# EAGLE design buisiness_card (EAGLE 7.5.0)
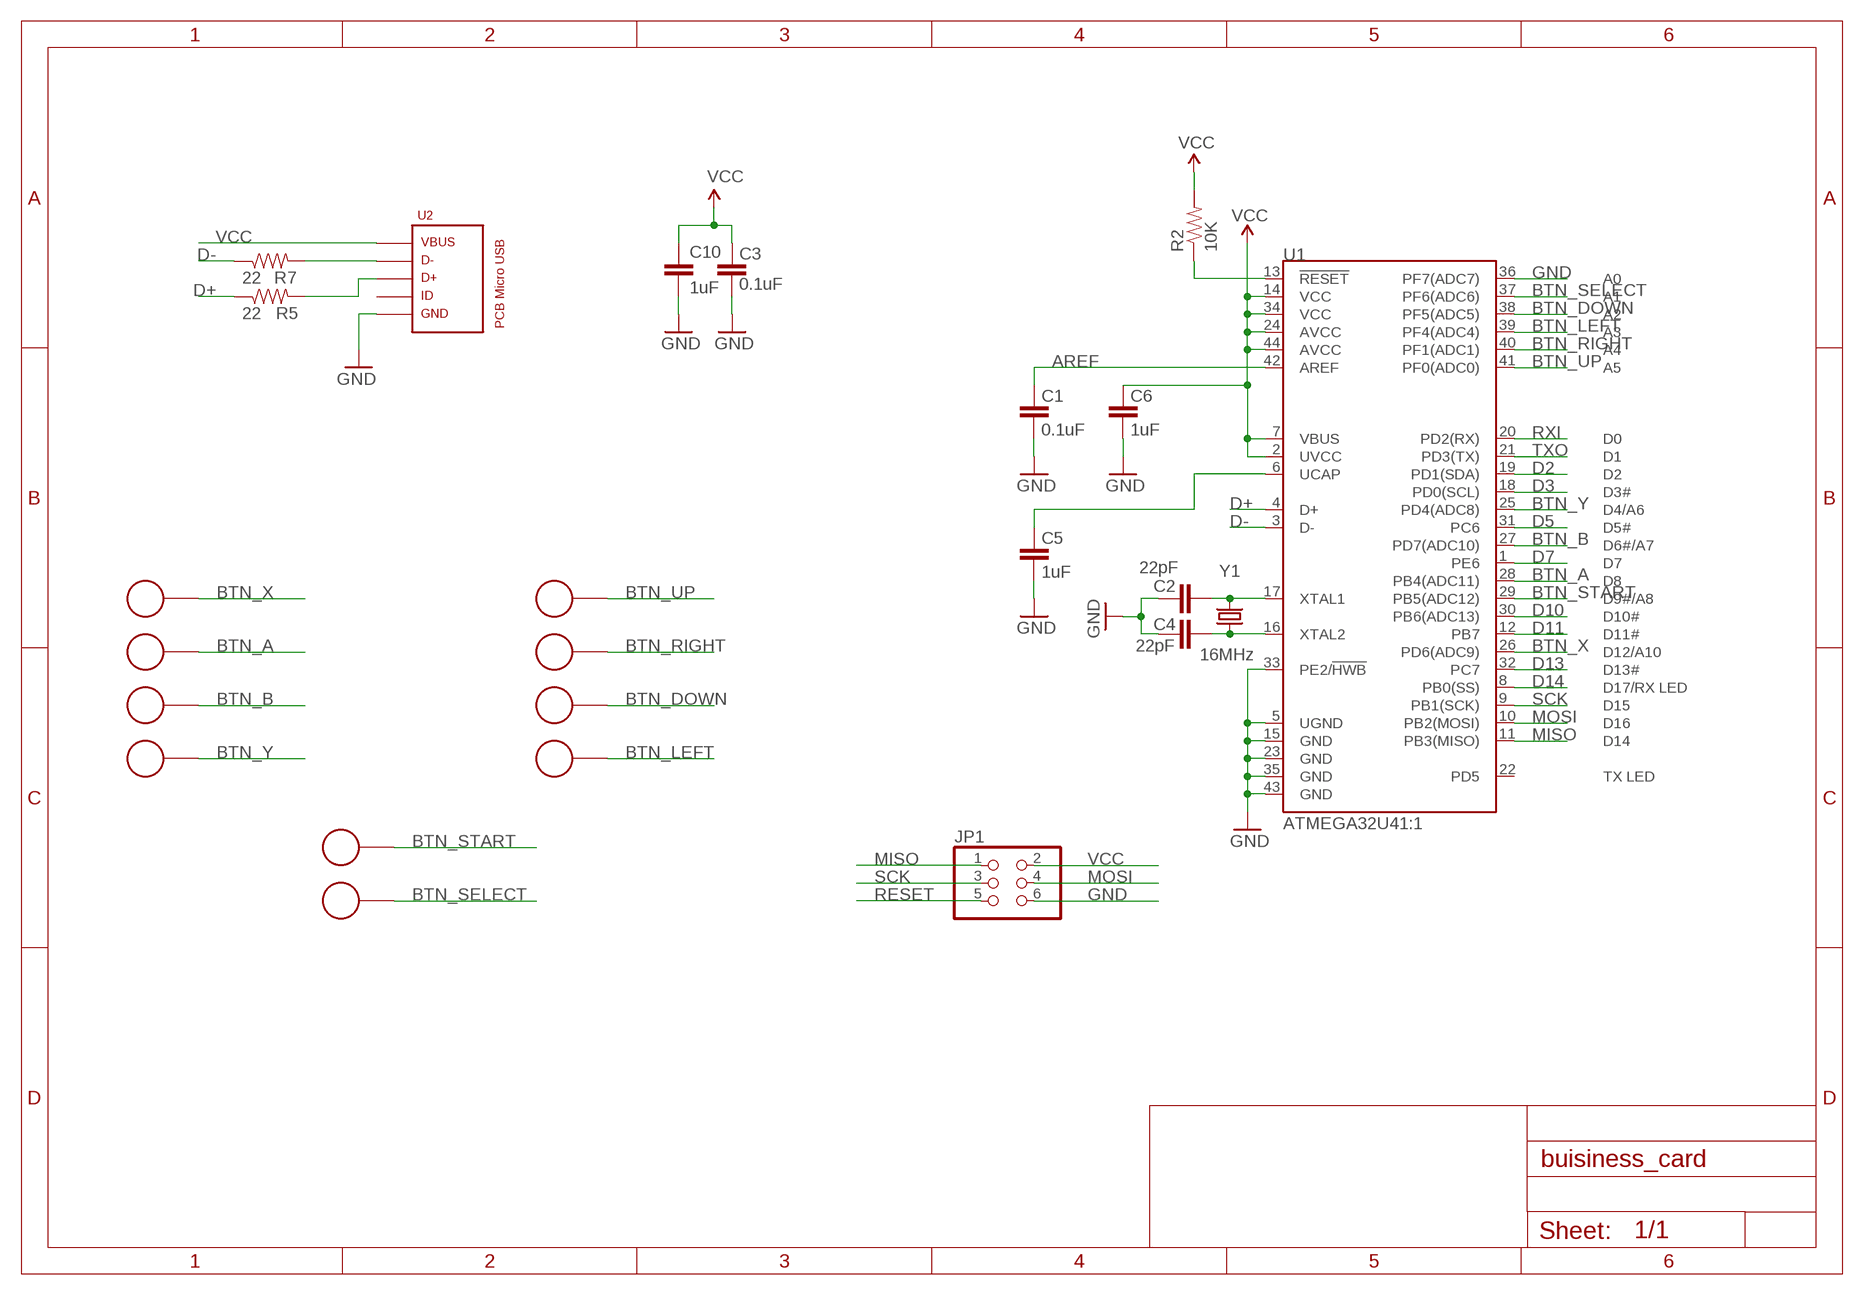
[diagram p0: schematic, sheet 1]

## Parts
B1  CAPACITIVE_BUTTON  [ROUND_CAP_BUTTON]
B2  CAPACITIVE_BUTTON  [ROUND_CAP_BUTTON]
B3  CAPACITIVE_BUTTON  [ROUND_CAP_BUTTON]
B4  CAPACITIVE_BUTTON  [ROUND_CAP_BUTTON]
B5  CAPACITIVE_BUTTON  [ROUND_CAP_BUTTON]
B6  CAPACITIVE_BUTTON  [ROUND_CAP_BUTTON]
B7  CAPACITIVE_BUTTON  [ROUND_CAP_BUTTON]
B8  CAPACITIVE_BUTTON  [ROUND_CAP_BUTTON]
B9  CAPACITIVE_BUTTON  [ROUND_CAP_BUTTON]
B10  CAPACITIVE_BUTTON  [ROUND_CAP_BUTTON]
C1  0.1uF  CAP0603-CAP  [0603-CAP]
C2  22pF  CAP0603-CAP  [0603-CAP]
C3  0.1uF  CAP0603-CAP  [0603-CAP]
C4  22pF  CAP0603-CAP  [0603-CAP]
C5  1uF  CAP0603-CAP  [0603-CAP]
C6  1uF  CAP0603-CAP  [0603-CAP]
C10  1uF  CAP0603-CAP  [0603-CAP]
JP1  PINHD-2X3  [2X03]
R2  10K  RESISTOR0603-RES  [0603-RES]
R5  22  RESISTOR0603-RES  [0603-RES]
R7  22  RESISTOR0603-RES  [0603-RES]
U1  ATMEGA32U41:1  [QFN-44-NOPAD_1:1]
U2  PCB_MICRO_USB_BSS_2  [USB_TYPE_B_SS_2]
Y1  16MHz  CRYSTAL5X3  [CRYSTAL-SMD-5X3]

## Nets
AREF: C1.2 U1.42(AREF)
BTN_A: B2.P$1 U1.28(PB4(ADC11))
BTN_B: B3.P$1 U1.27(PD7(ADC10))
BTN_DOWN: B7.P$1 U1.38(PF5(ADC5))
BTN_LEFT: B8.P$1 U1.39(PF4(ADC4))
BTN_RIGHT: B6.P$1 U1.40(PF1(ADC1))
BTN_SELECT: B10.P$1 U1.37(PF6(ADC6))
BTN_START: B9.P$1 U1.29(PB5(ADC12))
BTN_UP: B5.P$1 U1.41(PF0(ADC0))
BTN_X: B1.P$1 U1.26(PD6(ADC9))
BTN_Y: B4.P$1 U1.25(PD4(ADC8))
D2: U1.19(PD1(SDA))
D3: U1.18(PD0(SCL))
D5: U1.31(PC6)
D7: U1.1(PE6)
D10: U1.30(PB6(ADC13))
D11: U1.12(PB7)
D13: U1.32(PC7)
D14: U1.8(PB0(SS))
D+: R5.1 U1.4(D+)
D-: R7.1 U1.3(D-)
GND [vcc]: C1.1 C2.2 C3.1 C4.2 C5.1 C6.1 C10.2 JP1.6 U1.5(UGND) U1.15(GND) U1.23(GND) U1.33(PE2/!HWB) U1.35(GND) U1.36(PF7(ADC7)) U1.43(GND) U2.5
MISO: JP1.1 U1.11(PB3(MISO))
MOSI: JP1.4 U1.10(PB2(MOSI))
N$13: C4.1 U1.16(XTAL2) Y1.1
N$14: C2.1 U1.17(XTAL1) Y1.3
N$15: C5.2 U1.6(UCAP)
N$18: R7.2 U2.2
N$19: R5.2 U2.3
RESET: JP1.5 R2.1 U1.13(!RESET)
RXI: U1.20(PD2(RX))
SCK: JP1.3 U1.9(PB1(SCK))
TXO: U1.21(PD3(TX))
VCC: C3.2 C6.2 C10.1 JP1.2 R2.2 U1.2(UVCC) U1.7(VBUS) U1.14(VCC) U1.24(AVCC) U1.34(VCC) U1.44(AVCC) U2.1
Unconnected: U1.22(PD5) U2.4

## Library data of the parts
B1-B10 = MyLibrary:CAPACITIVE_BUTTON
C1-C6 C10 = SparkFun:CAP: Capacitor Standard 0603 ceramic capacitor, and 0.1" leaded capacitor.
JP1 = pinhead:PINHD-2X3: PIN HEADER
R2 R5 R7 = SparkFun:RESISTOR: Resistor Basic schematic elements and footprints for 0603, 1206, and PTH resistors.
U1 = SparkFun-DigitalIC:ATMEGA32U4: Atmel 44-pin 8-bit Microcontroller with 32KBytes of ISP Flash and USB Controller
U2 = USB_pcb_connectors:PCB_MICRO_USB_B
Y1 = SparkFun:CRYSTAL: Crystals Various standard crystals. Proven footprints. Spark Fun Electronics SKU : COM-00534

## Board
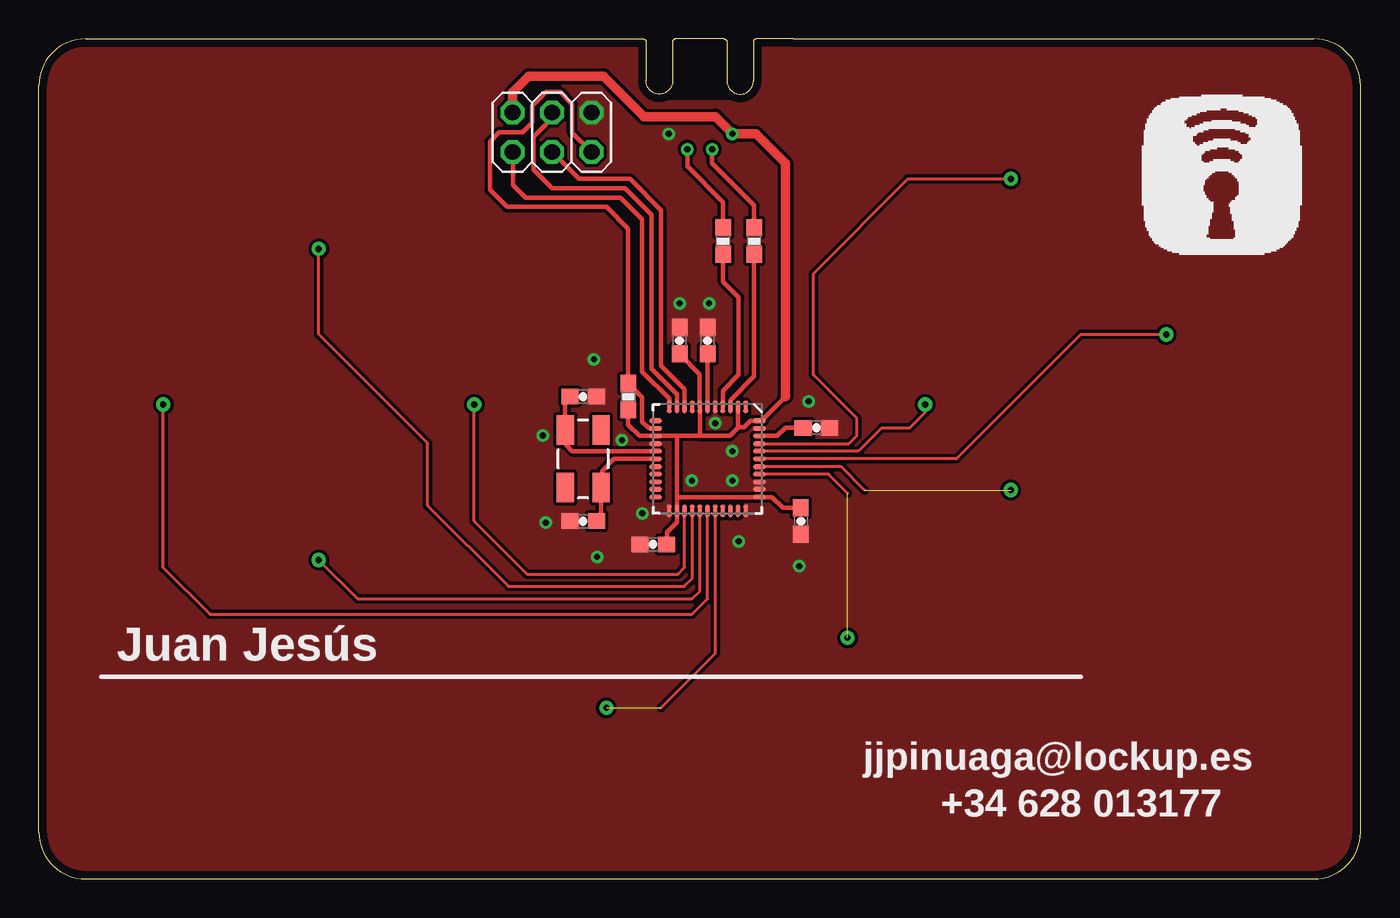
[diagram p1: board, top side]
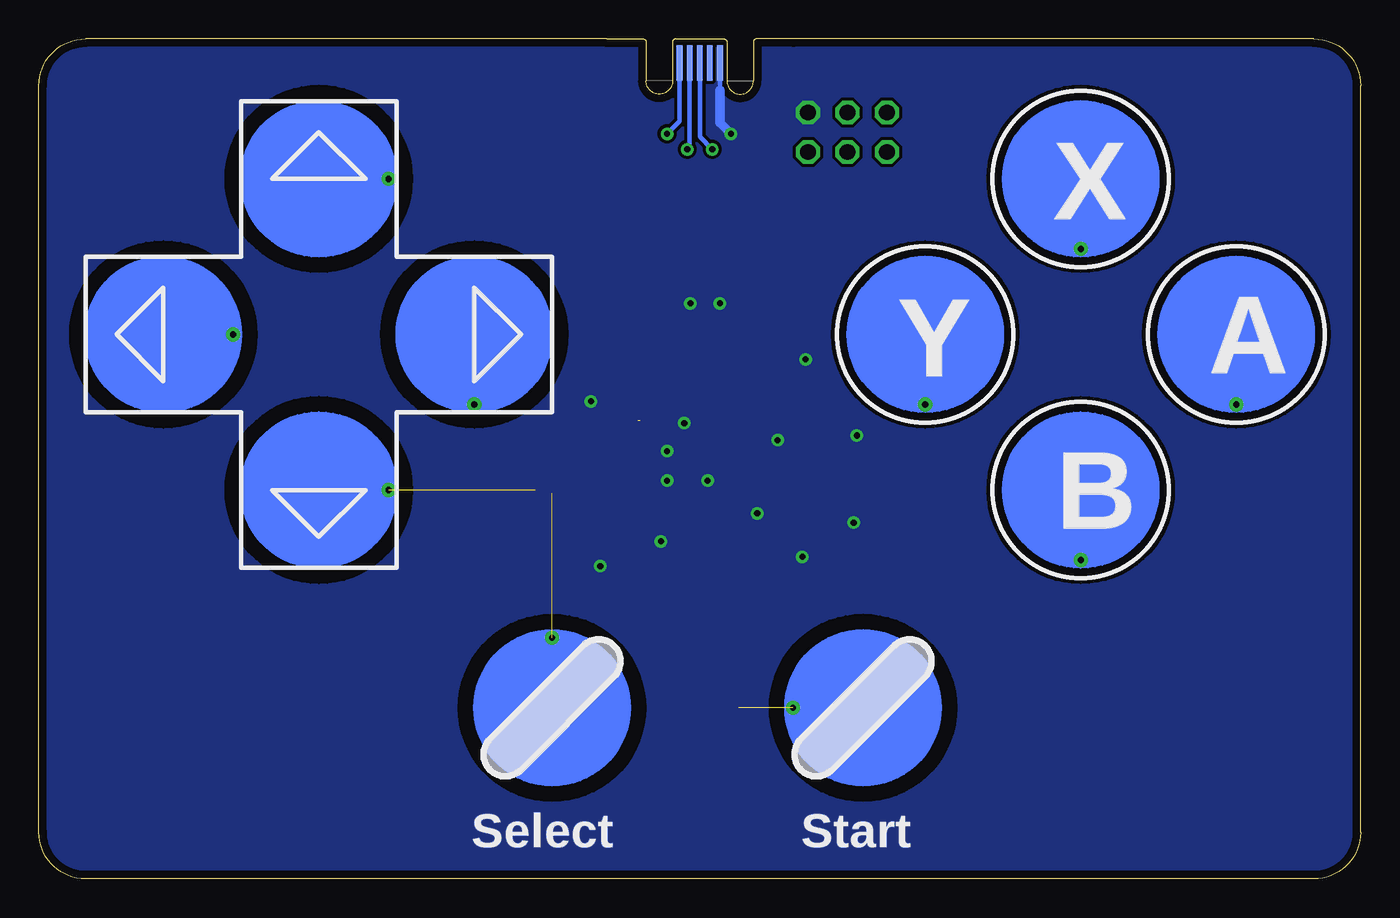
[diagram p2: board, bottom side, seen from below]

Size 85 x 54 mm. Coordinates in mm from the lower left corner, seen from the top.
Outline: 36.5,54 3,54 arc90 0,51 0,3 arc90 3,0 82,0 arc90 85,3 85,51 arc90 82,54 48.5,54
Copper layers (1*16): Top 0.035mm / dielectric 1.5mm / Bottom 0.035mm
Design rules "default *": minimum track width 10mil, minimum drill 24mil, track to track 8mil, track to pad 8mil, pad to pad 8mil, via to via 8mil, smd to smd 8mil, copper to edge 20mil, drill to drill 8mil, minimum pad ring 10mil, minimum via ring 8mil, stop-mask expansion 4mil, vias tented up to drill 100mil, thermal gap 10mil

### Footprints (pad centres in the part's own frame; a part is rotated, then mirrored left to right if it is on the bottom)
ROUND_CAP_BUTTON = drill 0.4: P$1 0,-4.5
0603-CAP = smd 1.1 x 1: 1 -0.85,0; 2 0.85,0
2X03 = drill 1.016 octagon: 1 -2.54,-1.27; 2 -2.54,1.27; 3 0,-1.27; 4 0,1.27; 5 2.54,-1.27; 6 2.54,1.27
0603-RES = smd 1.1 x 1: 1 -0.85,0; 2 0.85,0
QFN-44-NOPAD_1:1 = smd 0.8 x 0.3: 1 -3.337,2.458; 2 -3.337,1.958; 3 -3.337,1.479; 4 -3.337,0.979; 5 -3.337,0.5; 6 -3.337,0; 7 -3.337,-0.5; 8 -3.337,-0.979; 9 -3.337,-1.479; 10 -3.337,-1.958; 11 -3.337,-2.458; 23 3.337,-2.458; 24 3.337,-1.958; 25 3.337,-1.479; 26 3.337,-0.979; 27 3.337,-0.5; 28 3.337,0; 29 3.337,0.5; 30 3.337,0.979; 31 3.337,1.479; 32 3.337,1.958; 33 3.337,2.458 | smd 0.3 x 0.8: 12 -2.458,-3.337; 13 -1.958,-3.337; 14 -1.479,-3.337; 15 -0.979,-3.337; 16 -0.5,-3.337; 17 0,-3.337; 18 0.5,-3.337; 19 0.979,-3.337; 20 1.479,-3.337; 21 1.958,-3.337; 22 2.458,-3.337; 34 2.458,3.337; 35 1.958,3.337; 36 1.479,3.337; 37 0.979,3.337; 38 0.5,3.337; 39 0,3.337; 40 -0.5,3.337; 41 -0.979,3.337; 42 -1.479,3.337; 43 -1.958,3.337; 44 -2.458,3.337
USB_TYPE_B_SS_2 = smd 0.37 x 2.3: 1 -1.3,-1.55; 2 -0.65,-1.55; 3 0,-1.55; 4 0.65,-1.55; 5 1.3,-1.55
CRYSTAL-SMD-5X3 = smd 1.9 x 1.1: 1 -1.85,-1.15; 2 1.85,-1.15; 3 1.85,1.15; 4 -1.85,1.15

### Placement (x,y rotation side)
B1  18,45 0 bottom
B2  8,35 0 bottom
B3  18,25 0 bottom
B4  28,35 0 bottom
B5  67,45 90 bottom
B6  57,35 0 bottom
B7  67,25 90 bottom
B8  77,35 90 bottom
B9  32,11 270 bottom
B10  52,11 180 bottom
C1  50,29 180 top
C2  35,23 180 top
C3  39.5,21.5 0 top
C4  35,31 0 top
C5  43,34.6 270 top
C6  41.2,34.6 270 top
C10  49,23 270 top
JP1  33,48 0 top
R2  37.9,31 270 top
R5  44,41 90 top
R7  46,41 90 top
U1  43,27 270 top
U2  42.5,54 0 bottom
Y1  35,27 270 top

### Tracks (layer width: path | path; a pad name or v marks a point on that pad's centre or on a via)
AREF
  Top 0.305: C1.2 48,29 47.48,28.48 U1.42
BTN_A
  Top 0.203: U1.28 43,18 42,17 11,17 8,20 B2.P$1
BTN_B
  Top 0.203: U1.27 42.5,18.5 42,18 20.5,18 B3.P$1
BTN_DOWN  (1 unrouted)
  Top 0.203: 53.1,25 51.6,26.5 U1.38
BTN_LEFT
  Top 0.203: U1.39 59,27 67,35 B8.P$1
BTN_RIGHT
  Top 0.203: B6.P$1 57,30 56,29 54.2,29 52.7,27.5 U1.40
BTN_SELECT  (1 unrouted)
  Top 0.203: 52,24.8 50.78,26.02 U1.37
BTN_START  (1 unrouted)
  Top 0.203: U1.29 43.5,14.5 40,11
BTN_UP
  Top 0.203: B5.P$1 55.9,45 49.8,38.9 49.8,32.4 52.6,29.6 52.6,28.5 52.08,27.98 U1.41
BTN_X
  Top 0.203: 42,23.64 U1.26 42.02,19.32 41.5,18.8 30.2,18.8 25,24 25,28 18,35 B1.P$1
BTN_Y
  Top 0.203: 41.5,23.64 U1.25 41.52,20.02 41.1,19.6 31.4,19.6 28,23 B4.P$1
D+
  Top 0.305: U1.4 43.98,31.38 45,32.4 45,37.4 44,38.4 R5.1
D-
  Top 0.305: R7.1 46,32.3 44.48,30.78 U1.3
GND  (via drill 0.4)
  Bottom 0.305: 41.2,50.7 U2.5
  Bottom 0.61: v40.5,47.9 41.2,48.6 41.2,50.7
  other vias: 32.4,28.5 32.6,22.9 35.9,20.7 38.8,23.5 37.5,28.2 43.5,29.3 42,25.6 44.6,27.5 44.6,25.6 45,21.7 48.9,20.1 49.5,30.7 35.7,33.4 41.2,37 43.1,37
  pour Top (no thermals): 0,54 40,54 40,50 45,50 45,54 85,54 85,0 0,0
  pour Bottom (no thermals): 0,54 85,54 85,0 0,0
MISO
  Top 0.305: JP1.1 30.5,46.69 30.5,44.6 31.3,43.8 37.4,43.8 38.8,42.4 38.8,32.6 40.54,30.86 U1.11
MOSI
  Top 0.305: JP1.4 33,48.9 31.8,47.7 31.8,45.6 33,44.4 37.7,44.4 39.4,42.7 39.4,32.8 41.04,31.16 U1.10
N$13
  Top 0.305: U1.16 34.3,27.5 33.9,27.9 33.9,28.8 Y1.1 33.85,30.7 C4.1
N$14
  Top 0.305: U1.17 37,27 36.2,26.2 36.2,25.2 Y1.3 36.15,23.3 C2.1
N$15
  Top 0.305: C5.2 U1.6
N$18  (via drill 0.4)
  Top 0.305: R7.2 46,43.3 43.3,46 v43.3,46.9
  Bottom 0.305: U2.2 43.15,47.05 v43.3,46.9
N$19  (via drill 0.4)
  Top 0.305: R5.2 44,43.5 41.7,45.8 v41.7,46.9
  Bottom 0.305: U2.3 42.5,47.7 v41.7,46.9
RESET
  Top 0.305: JP1.5 34.3,47.97 34.3,49.8 33.5,50.6 32.6,50.6 31.7,49.7 31.7,48.6 31.1,48 29.6,48 29,47.4 29,44.3 30.1,43.2 36.5,43.2 37.9,41.8 R2.1 38.8,30.95 38.8,29.4 39.24,28.96 U1.13
SCK
  Top 0.305: JP1.3 34.73,45 38,45 40,43 40,33 41.52,31.48 U1.9
VCC  (via drill 0.4)  (1 unrouted)
  Top 0.203: 45.96,29.46 U1.44
  Top 0.305: 48,31 46.46,29.46 | R2.2 37.9,29.2 38.62,28.48 U1.14 41.02,28.48 | C3.2 40.4,21.55 40.4,22.3 41.04,22.94 U1.24 41.04,24.5 | C10.1 47.85,23.85 47.16,24.54 U1.34 41.09,24.54 41.04,24.5 | U1.44 45.76,29.46 45.34,29.04 45,29.04 | 41.04,24.5 41.04,28.46 41.02,28.48 | C6.2 42.5,32.45 U1.7 42.5,28.48 | U1.2 44.96,29.04 45,29.04 | 42.5,28.48 44.44,28.48 45,29.04 | 42.5,28.48 41.02,28.48
  Top 0.61: JP1.2 30.46,50.56 31.5,51.6 36.3,51.6 38.9,49 43.5,49 v44.6,47.9 46.1,47.9 48,46 48,31
  Bottom 0.305: U2.1 43.8,48.7 v44.6,47.9

### Text on the board
tPlace: Juan Jesús | jjpinuaga@lockup.es | +34 628 013177
bPlace: X | A | Y | B | Start | Select
tStop: Pinuaga | Engineer